# Altium schematic sheet ERN_Main_2.SchDoc
size A; SheetNumber: 2; SheetTotal: 2; SPICEModelCacheYVUKJMZF: <root> / <DocumentId>YVUKJMZF</DocumentId> / <CacheFrame Number="0"> / <Model Name="1n4148" Kind="MDL"> / <Text>.model 1N4148  D(Is=0.1p Rs=16 CJO=2p Tt=12n Bv=100 Ibv=0.1p)</Text> / </Model> / <Model Name="npn" Kind="MDL"> / <Text>*Default NPN BJT / *NPN Trans Pinout: C,B,E / .MODEL NPN NPN()</Text> / </Model> / <Model Name="pnp" Kind="MDL"> / <Text>*Default PNP BJT / *PNP Trans Pinout: C,B,E / .MODEL PNP PNP()</Text> / </Model> / </CacheFrame> / </root>
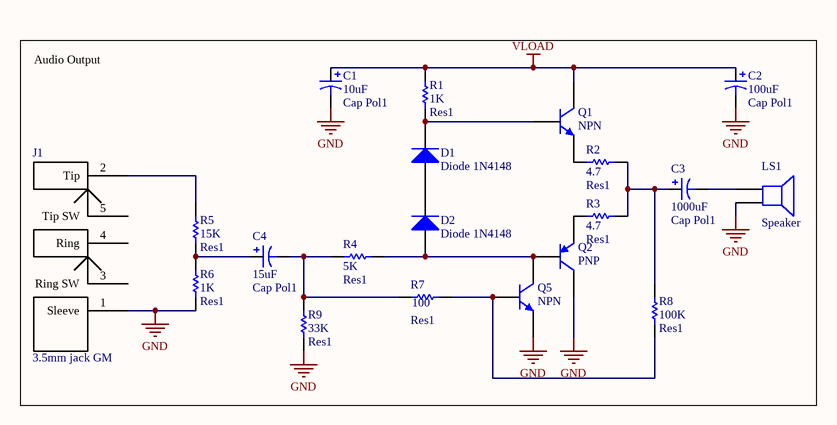
[diagram p0: ERN_Main_2.SchDoc]

## Parts
C1  Cap Pol1  value 10uF  [Cap_10uF]
C2  Cap Pol1  value 100uF  [Cap_47uF_100uF]
C3  Cap Pol1  value 1000uF  [Cap_1000uF]
C4  Cap Pol1  value 15uF  [Cap_10uF]
D1  Diode 1N4148  [DO-35]
D2  Diode 1N4148  [DO-35]
J1  3.5mm jack GM  [3.5mm jack GM]
LS1  Speaker  [PIN2]
Q1  NPN  [TO92254P460H750-3]
Q2  PNP  [TO92254P460H750-3]
Q5  NPN  [TO92254P460H750-3]
R1  Res1  value 1K  [AXIAL-0.3]
R2  Res1  value 4.7  [AXIAL-0.3]
R3  Res1  value 4.7  [AXIAL-0.3]
R4  Res1  value 5K  [AXIAL-0.3]
R5  Res1  value 15K  [AXIAL-0.3]
R6  Res1  value 1K  [AXIAL-0.3]
R7  Res1  value 100  [AXIAL-0.3]
R8  Res1  value 100K  [AXIAL-0.3]
R9  Res1  value 33K  [AXIAL-0.3]

## Blocks framed on the sheet
Audio Output: C1-C4 D1 D2 J1 LS1 Q1 Q2 Q5 R1-R9

## Nets
GND: C1.2 C2.2 J1.1(Sleeve) LS1.2 Q2.1(C) Q5.3(E) R6.1 R9.1
VLOAD: C1.1 C2.1 Q1.1(C) R1.2
NetC3_1: C3.1 R2.2 R3.2 R8.2
NetC3_2: C3.2 LS1.1
NetC4_1: C4.1 R5.1 R6.2
NetC4_2: C4.2 R4.1 R7.1 R9.2
NetD1_1: D1.1(A) D2.2(K)
NetD1_2: D1.2(K) Q1.2(B) R1.1
NetD2_1: D2.1(A) Q2.2(B) Q5.1(C) R4.2
NetJ1_2: J1.2(Tip) R5.2
NetQ1_3: Q1.3(E) R2.1
NetQ2_3: Q2.3(E) R3.1
NetQ5_2: Q5.2(B) R7.2 R8.1

Not connected (* = marked no-connect by the designer): J1 3(Ring_SW) 4(Ring) 5(Tip_SW)

## Library data of the parts
C1-C4 = Cap Pol1: Polarized Capacitor (Radial); Published: 8-Jun-2000; LatestRevisionDate: 17-Jul-2002; LatestRevisionNote: Re-released for DXP Platform.; PackageReference: RB7.6-15; Publisher: Altium Limited; PackageDescription: Polarized Capacitor (Radial); 2 Leads
D1 D2 = Diode 1N4148: High Conductance Fast Diode; Published: 8-Jun-2000; LatestRevisionDate: 17-Jul-2002; LatestRevisionNote: Re-released for DXP Platform.; DatasheetVersion: 1997; PackageReference: DO-35; Publisher: Altium Limited; PackageDescription: Diode, Axial; Body 3.8 x 1.9 mm (LxDia. max), Lead Dia. 0.53 mm (max); Code_JEDEC: DO-204-AH; ComponentLink1Description: Manufacturer Link; ComponentLink1URL: http://www.fairchildsemi.com/; ComponentLink2Description: Datasheet; ComponentLink2URL: http://www.fairchildsemi.com/ds/1N%2F1N4148.pdf
LS1 = Speaker: Loudspeaker; Published: 24-Mar-1999; LatestRevisionDate: 17-Jul-2002; LatestRevisionNote: Re-released for DXP Platform.; PackageReference: PIN2; Publisher: Altium Limited
Q1 Q5 = NPN: NPN Bipolar Transistor; Published: 8-Jun-2000; LatestRevisionDate: 17-Jul-2002; LatestRevisionNote: Re-released for DXP Platform.; PackageReference: TO-226-AA; Publisher: Altium Limited; PackageDescription: TO, Flat Index; 3 In-Line, Axial Leads; Body Dia. 4.8mm; Leads 0.55 x 0.51 mm (max); Code_JEDEC: TO-226-AA
Q2 = PNP: PNP Bipolar Transistor; Published: 8-Jun-2000; LatestRevisionDate: 29-May-2009; LatestRevisionNote: IPC-7351 Footprint Added.; PackageVersion: Aug-1999; PackageReference: SOT-23B; Publisher: Altium Limited; PackageDescription: 3-Pin SOT-23 Package 0.95 mm Pitch, 2.4 mm Lead Span
R1-R9 = Res1: Resistor; Published: 8-Jun-2000; LatestRevisionDate: 17-Jul-2002; LatestRevisionNote: Re-released for DXP Platform.; PackageReference: AXIAL-0.3; Publisher: Altium Limited; PackageDescription: Axial Device, Thru-Hole; 2 Leads; 0.3 in Pin Spacing